# EAGLE design 25_Servo_Controller_v7.1 (EAGLE 5.00)
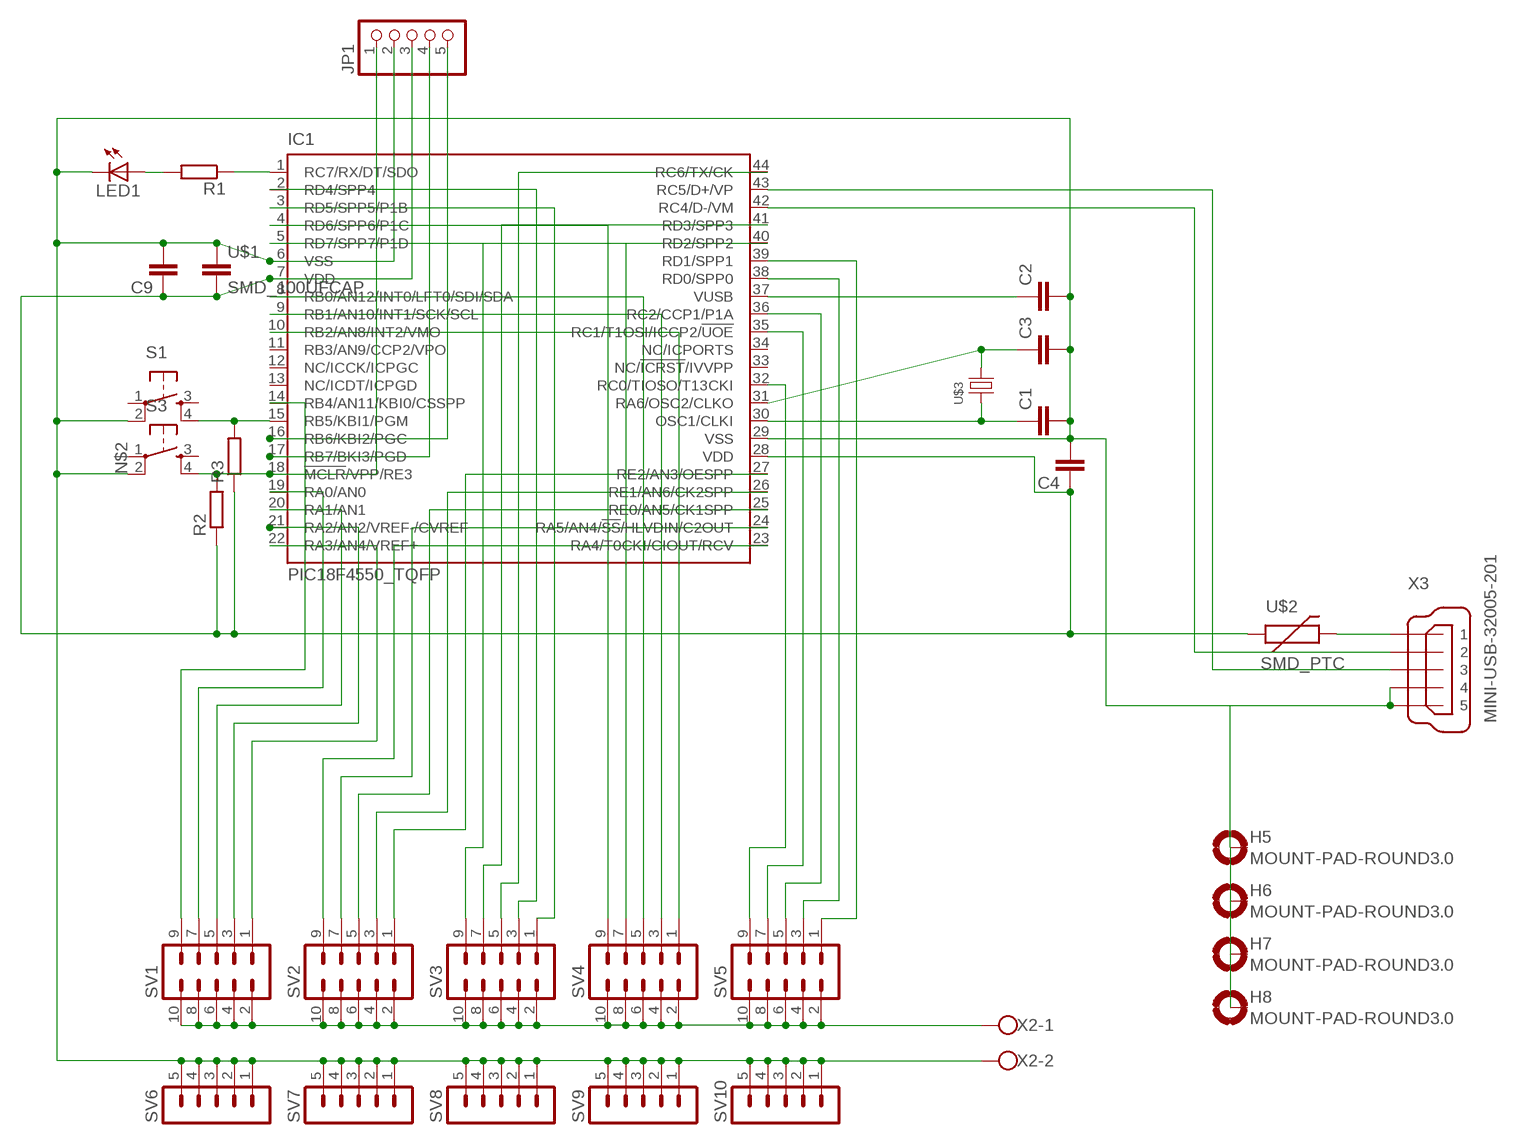
[diagram p0: schematic, sheet 1]

## Parts
C1  C-EUC0504  [C0504]
C2  C-EUC0504  [C0504]
C3  C-EUC0504  [C0504]
C4  C-EUC0504  [C0504]
C9  C-EUC0504  [C0504]
H5  MOUNT-PAD-ROUND3.0  [3,0-PAD]
H6  MOUNT-PAD-ROUND3.0  [3,0-PAD]
H7  MOUNT-PAD-ROUND3.0  [3,0-PAD]
H8  MOUNT-PAD-ROUND3.0  [3,0-PAD]
IC1  PIC18F4550_TQFP  [TQFP44]
JP1  PINHD-1X5  [1X05]
LED1  LED0603  [LED-0603]
R1  R-EU_R0402  [R0402]
R2  R-EU_R0402  [R0402]
R3  R-EU_R0402  [R0402]
S1  TAC_SWITCHSMD  [TACTILE_SWITCH_SMD]
S3  TAC_SWITCHSMD  [TACTILE_SWITCH_SMD]
SV1  MA05-2  [MA05-2]
SV2  MA05-2  [MA05-2]
SV3  MA05-2  [MA05-2]
SV4  MA05-2  [MA05-2]
SV5  MA05-2  [MA05-2]
SV6  MA05-1  [MA05-1]
SV7  MA05-1  [MA05-1]
SV8  MA05-1  [MA05-1]
SV9  MA05-1  [MA05-1]
SV10  MA05-1  [MA05-1]
U$1  SMD_100UFCAP  [SMD_100UFCAP]
U$2  SMD_PTC  [SMD_PTC]
U$3  SMD_CRYSTAL  [SMD_CRYSTAL]
X2  W237-102  [W237-102]
X3  MINI-USB-32005-201  [32005-201]

## Nets
GND: C1.2 C2.2 C3.2 C4.2 C9.2 H5.B3,0(MOUNT) H6.B3,0(MOUNT) H7.B3,0(MOUNT) H8.B3,0(MOUNT) IC1.6(VSS) IC1.29(VSS) JP1.2 LED1.C S1.2 S3.2 SV6.1 SV6.2 SV6.3 SV6.4 SV6.5 SV7.1 SV7.2 SV7.3 SV7.4 SV7.5 SV8.1 SV8.2 SV8.3 SV8.4 SV8.5 SV9.1 SV9.2 SV9.3 SV9.4 SV9.5 SV10.1 SV10.2 SV10.3 SV10.4 SV10.5 U$1.1 X2.2 X3.4 X3.5
N$1: U$2.2 X3.1
N$2: IC1.18(!MCLR!/VPP/RE3) JP1.1 R2.2 S3.4
N$3: IC1.1(RC7/RX/DT/SDO) R1.1
N$4: LED1.A R1.2
N$5: C2.1 IC1.37(VUSB)
N$6: C3.1 IC1.31(RA6/OSC2/CLKO) U$3.3
N$7: C4.1 C9.1 IC1.7(VDD) IC1.28(VDD) JP1.3 R2.1 R3.1 U$1.2 U$2.1
N$8: IC1.15(RB5/KBI1/PGM) R3.2 S1.4
N$9: SV1.2 SV1.4 SV1.6 SV1.8 SV1.10 SV2.2 SV2.4 SV2.6 SV2.8 SV2.10 SV3.2 SV3.4 SV3.6 SV3.8 SV3.10 SV4.2 SV4.4 SV4.6 SV4.8 SV4.10 SV5.2 SV5.4 SV5.6 SV5.8 SV5.10 X2.1
N$10: IC1.14(RB4/AN11/KBI0/CSSPP) SV1.9
N$11: IC1.19(RA0/AN0) SV1.7
N$13: IC1.43(RC5/D+/VP) X3.3
N$14: IC1.42(RC4/D-/VM) X3.2
N$15: IC1.20(RA1/AN1) SV1.5
N$16: IC1.23(RA4/T0CKI/CIOUT/RCV) SV2.9
N$17: IC1.24(RA5/AN4/!SS!/HLVDIN/C2OUT) SV2.7
N$18: IC1.22(RA3/AN4/VREF+) SV1.1
N$19: IC1.17(RB7/BKI3/PGD) JP1.4
N$20: IC1.16(RB6/KBI2/PGC) JP1.5
N$21: IC1.25(RE0/AN5/CK1SPP) SV2.5
N$22: IC1.21(RA2/AN2/VREF-/CVREF) SV1.3
N$23: IC1.26(RE1/AN6/CK2SPP) SV2.3
N$24: IC1.27(RE2/AN3/OESPP) SV2.1
N$25: IC1.32(RC0/TIOSO/T13CKI) SV5.9
N$26: IC1.35(RC1/T1OSI/ICCP2/!UOE) SV5.7
N$27: IC1.36(RC2/CCP1/P1A) SV5.5
N$28: IC1.38(RD0/SPP0) SV5.3
N$29: IC1.39(RD1/SPP1) SV5.1
N$30: IC1.40(RD2/SPP2) SV3.9
N$31: IC1.41(RD3/SPP3) SV3.7
N$32: IC1.44(RC6/TX/CK) SV3.5
N$33: IC1.2(RD4/SPP4) SV3.3
N$34: IC1.3(RD5/SPP5/P1B) SV3.1
N$35: IC1.4(RD6/SPP6/P1C) SV4.9
N$36: IC1.5(RD7/SPP7/P1D) SV4.7
N$37: IC1.8(RB0/AN12/INT0/LFT0/SDI/SDA) SV4.5
N$38: IC1.9(RB1/AN10/INT1/SCK/SCL) SV4.3
N$39: IC1.10(RB2/AN8/INT2/VMO) SV4.1
N$40: C1.1 IC1.30(OSC1/CLKI) U$3.2
Unconnected: IC1.11(RB3/AN9/CCP2/VPO) IC1.12(NC/ICCK/ICPGC) IC1.13(NC/ICDT/ICPGD) IC1.33(NC/!ICRST!/IVVPP) IC1.34(NC/ICPORTS) S1.1 S1.3 S3.1 S3.3

## Library data of the parts
C1-C4 C9 = resistor:C-EU: CAPACITOR, European symbol
H5-H8 = holes:MOUNT-PAD-ROUND: MOUNTING PAD, round
IC1 = microchip:PIC18F4*_TQFP: USB Microcontrollers with nanoWatt Technology High-Performance, Enhanced Flash, 28/40/44-Pin, Source: http://ww1.microchip.com/downloads/en/devicedoc/39632c.pdf
JP1 = pinhead:PINHD-1X5: PIN HEADER
LED1 = SparkFun:LED: LEDs Standard schematic elements and footprints for 5mm, 3mm, 1206, and 0603 sized LEDs. 5mm - Spark Fun Electronics SKU : COM-00529 (and others)
R1-R3 = rcl:R-EU_: RESISTOR, European symbol
S1 S3 = SparkFun:TAC_SWITCH: Momentary Switch Button commonly used for reset or general input. Spark Fun Electronics SKU : COM-00097
SV1-SV5 = con-lstb:MA05-2: PIN HEADER
SV6-SV10 = con-lstb:MA05-1: PIN HEADER
U$1 = endurance_rc:SMD_100UFCAP
U$2 = endurance_rc:SMD_PTC
U$3 = endurance_rc:SMD_CRYSTAL
X2 = con-wago-500:W237-102: WAGO SCREW CLAMP
X3 = con-cypressindustries:MINI-USB-: MINI USB-B Conector Source: www.cypressindustries.com

## Board
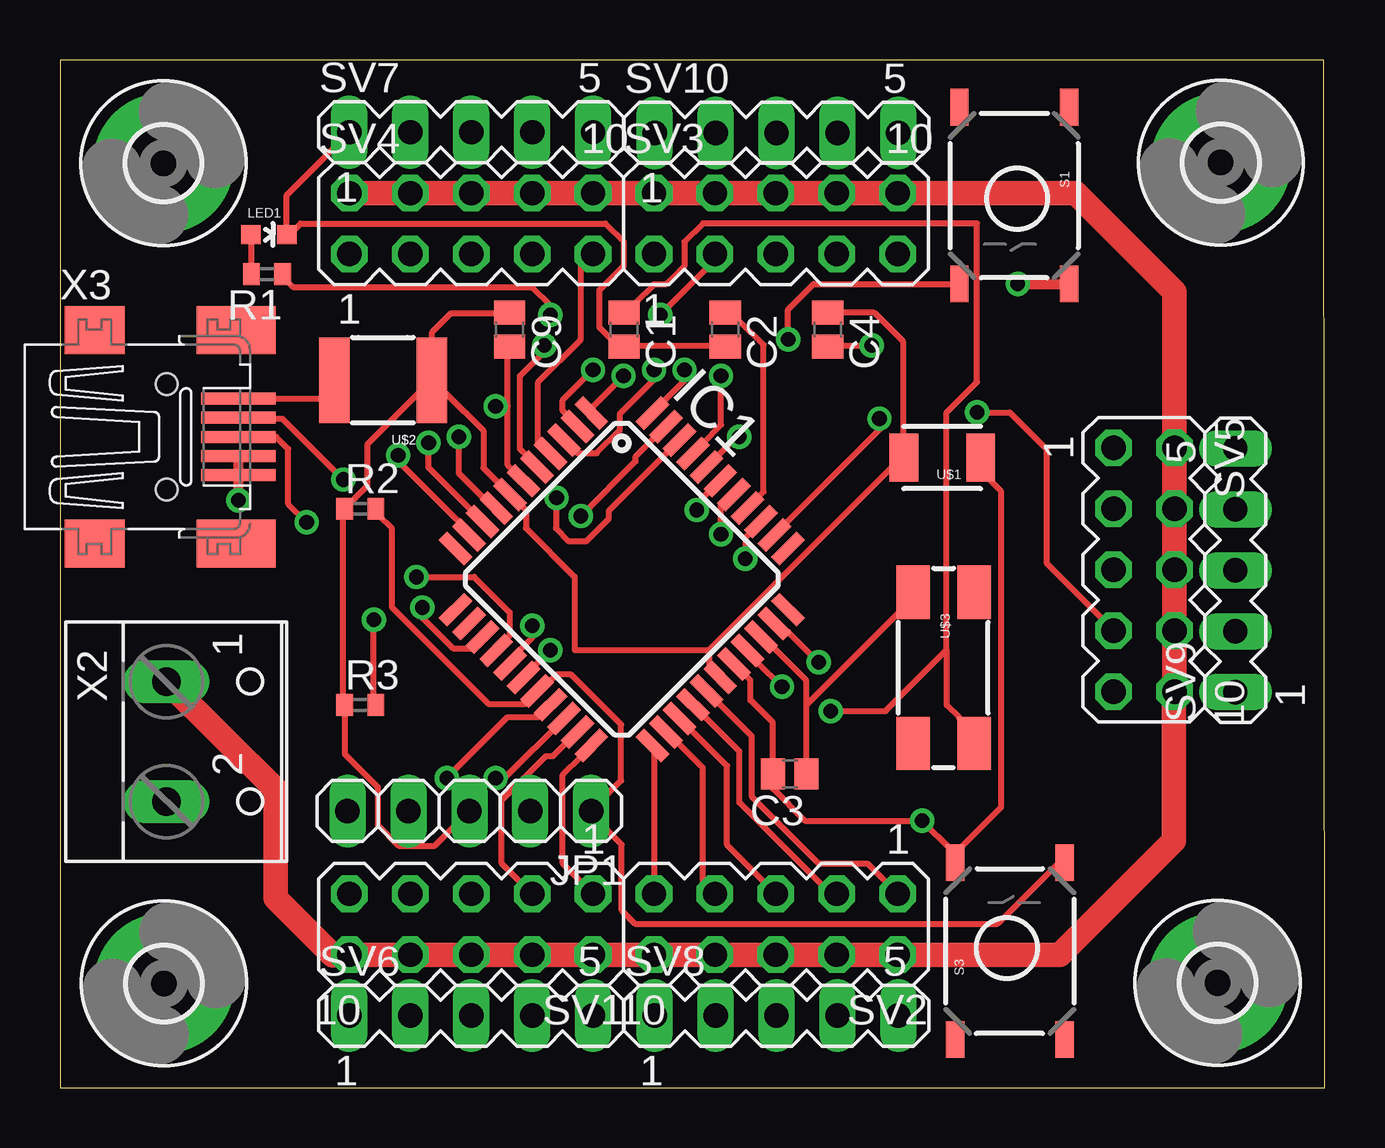
[diagram p1: board, top side]
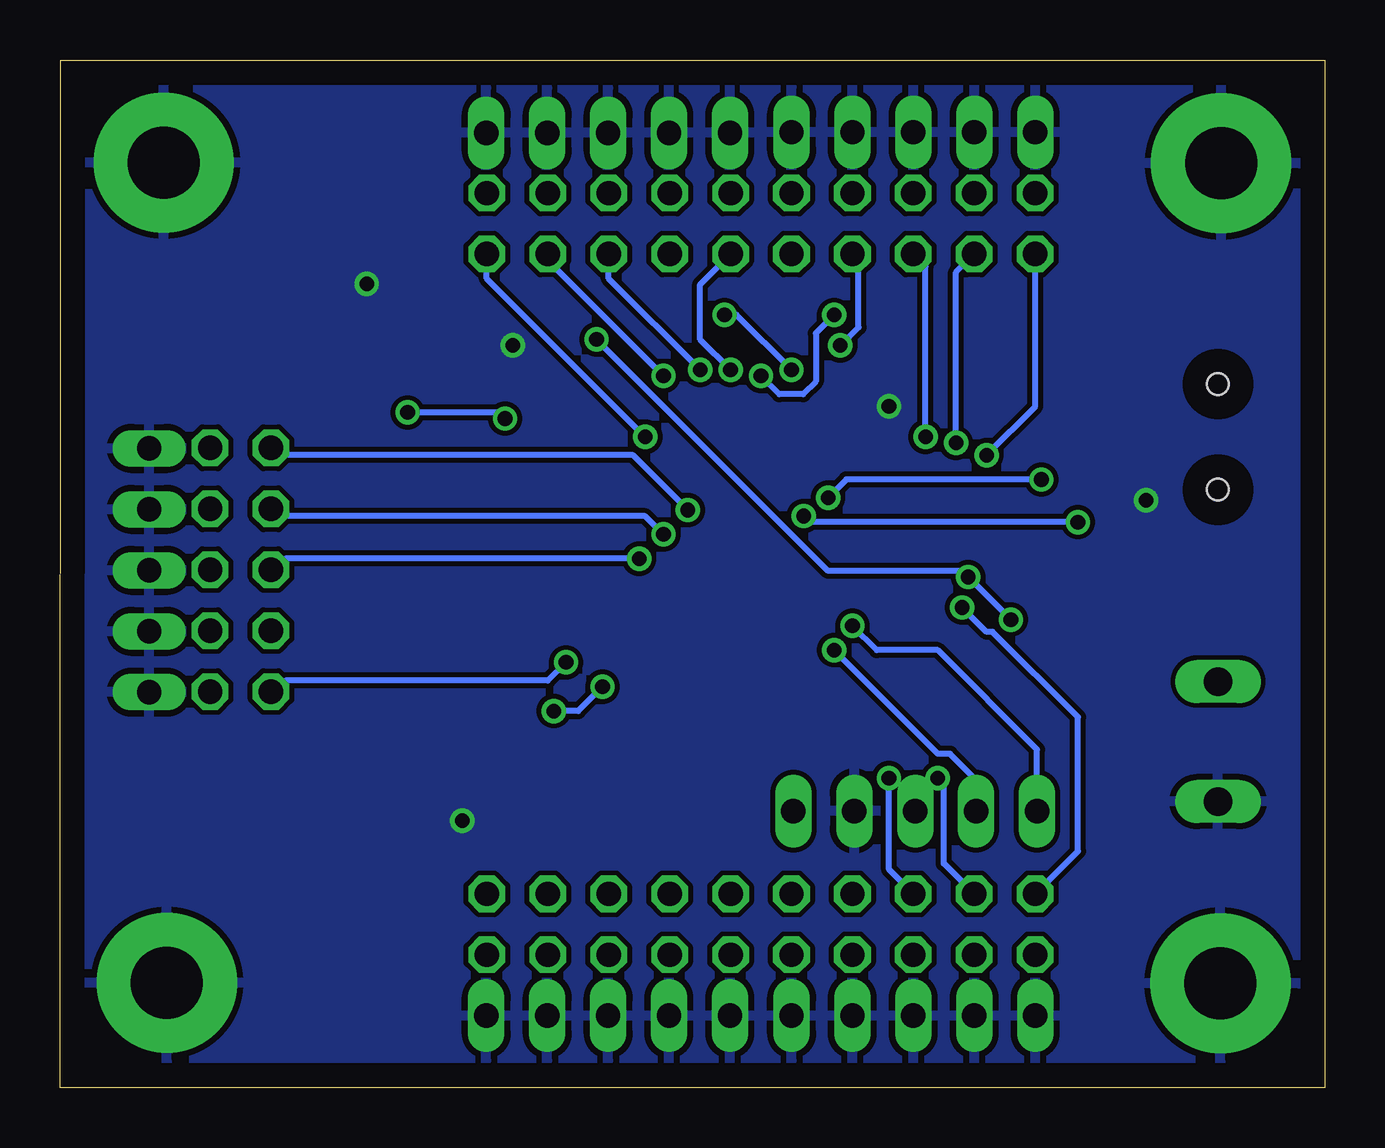
[diagram p2: board, bottom side, seen from below]

Size 52.71 x 42.85 mm. Coordinates in mm from the lower left corner, seen from the top.
Outline: 0,0 52.71,0 52.69,42.85 0,42.85 0,0
Copper layers (1*16): Top 0.035mm / dielectric 1.5mm / Bottom 0.035mm
Design rules "default *": minimum track width 10mil, minimum drill 24mil, track to track 8mil, track to pad 8mil, pad to pad 8mil, via to via 8mil, smd to smd 8mil, copper to edge 40mil, drill to drill 8mil, minimum pad ring 10mil, minimum via ring 8mil, stop-mask expansion 4mil, vias tented up to drill 0mil, thermal gap 10mil

### Footprints (pad centres in the part's own frame; a part is rotated, then mirrored left to right if it is on the bottom)
C0504 = smd 1 x 1.3: 1 -0.7,0; 2 0.7,0
3,0-PAD = drill 3 pad 5.842 round: B3,0 0,0
TQFP44 = smd 1.5 x 0.5: 1 -5.8,4; 2 -5.8,3.2; 3 -5.8,2.4; 4 -5.8,1.6; 5 -5.8,0.8; 6 -5.8,0; 7 -5.8,-0.8; 8 -5.8,-1.6; 9 -5.8,-2.4; 10 -5.8,-3.2; 11 -5.8,-4; 23 5.8,-4; 24 5.8,-3.2; 25 5.8,-2.4; 26 5.8,-1.6; 27 5.8,-0.8; 28 5.8,0; 29 5.8,0.8; 30 5.8,1.6; 31 5.8,2.4; 32 5.8,3.2; 33 5.8,4 | smd 0.5 x 1.5: 12 -4,-5.8; 13 -3.2,-5.8; 14 -2.4,-5.8; 15 -1.6,-5.8; 16 -0.8,-5.8; 17 0,-5.8; 18 0.8,-5.8; 19 1.6,-5.8; 20 2.4,-5.8; 21 3.2,-5.8; 22 4,-5.8; 34 4,5.8; 35 3.2,5.8; 36 2.4,5.8; 37 1.6,5.8; 38 0.8,5.8; 39 0,5.8; 40 -0.8,5.8; 41 -1.6,5.8; 42 -2.4,5.8; 43 -3.2,5.8; 44 -4,5.8
1X05 = drill 1.016 long: 1 -5.08,0; 2 -2.54,0; 3 0,0; 4 2.54,0; 5 5.08,0
LED-0603 = smd 0.8 x 0.8: A 0,-0.75; C 0,0.75
R0402 = smd 0.7 x 0.9: 1 -0.65,0; 2 0.65,0
TACTILE_SWITCH_SMD = smd 1.524 x 0.762: 1 -2.54,2.667; 2 4.826,2.667; 3 -2.54,-1.905; 4 4.826,-1.905
MA05-2 = drill 1.016 octagon: 1 -5.08,-1.27; 2 -5.08,1.27; 3 -2.54,-1.27; 4 -2.54,1.27; 5 0,-1.27; 6 0,1.27; 7 2.54,-1.27; 8 2.54,1.27; 9 5.08,-1.27; 10 5.08,1.27
MA05-1 = drill 1.016 long: 1 -5.08,0; 2 -2.54,0; 3 0,0; 4 2.54,0; 5 5.08,0
SMD_100UFCAP = smd 1.2 x 2: 1 -2.87,2.54; 2 0.33,2.54
SMD_PTC = smd 1.27 x 3.556: 1 -1.4,1.016; 2 2.664,1.016
SMD_CRYSTAL = smd 2.21 x 1.397: 1 -3.81,0.635; 2 2.489,0.635; 3 -3.81,-1.905; 4 2.489,-1.905
W237-102 = drill 1.194 long: 1 -2.5,-1.27; 2 2.5,-1.27
32005-201 = smd 3.1 x 0.5: 1 3,1.6; 2 3,0.8; 3 3,0; 4 3,-0.8; 5 3,-1.6 | smd 2.5 x 2: M1 -3,-4.45; M2 -3,4.45 | smd 3.3 x 2: M3 2.9,4.45; M4 2.9,-4.45 | hole 0.9: 0,2.2; 0,-2.2

### Placement (x,y rotation side)
C1  23.52,31.61 270 top
C2  27.73,31.61 270 top
C3  30.42,13.09 180 top
C4  32,31.61 270 top
C9  18.74,31.61 270 top
H5  4.34,4.36 0 top
H6  48.26,4.38 0 top
H7  48.38,38.57 0 top
H8  4.31,38.54 0 top
IC1  23.42,21.21 315 top
JP1  17.06,11.54 180 top
LED1  8.71,35.57 270 top
R1  8.63,33.92 180 top
R2  12.52,24.14 0 top
R3  12.52,15.96 0 top
S1  39.39,38.34 270 top
S3  39.97,4.56 90 top
SV1  17.14,6.82 180 top
SV2  29.84,6.82 180 top
SV3  29.84,36.03 0 top
SV4  17.14,36.03 0 top
SV5  45.18,21.6 270 top
SV6  17.14,3.01 0 top
SV7  17.14,39.84 0 top
SV8  29.87,3.01 0 top
SV9  48.99,21.58 90 top
SV10  29.87,39.81 0 top
U$1  35.5,28.82 180 top
U$2  14.09,30.52 180 top
U$3  37.46,16.85 270 top
X2  5.71,14.44 270 top
X3  4.44,27.14 0 top

### Tracks (layer width: path | path; a pad name or v marks a point on that pad's centre or on a via)
GND  (via drill 0.6, 0.61)
  Top 0.254: IC1.29 28.77,17 28.77,16.17 29.71,15.23 29.71,13.58 C3.2 29.71,12.48 31.06,11.14 v35.94,11.14 37.16,9.92 S3.2 37.46,9.94 39.24,11.72 39.24,24.85 38.73,25.36 U$1.1 | 18.66,28.41 18.66,25.97 18.92,25.72 IC1.6 | 18.66,28.41 18.66,30.44 C9.2 | X3.5 7.49,25.62 7.49,26.12 X3.4 | C2.2 27.3,30.95 24,30.95 C1.2 22.98,31.2 22.47,31.71 22.47,33.24 23.49,34.25 23.49,35.27 22.73,36.03 10.03,36.03 9.77,35.78 LED1.C 9.46,37.21 12.06,39.82 SV7.1 | v33.83,30.95 32.63,30.95 C4.2 | 18.66,28.41 v18.16,28.41
  Top 0.406: X3.4 7.44,24.6 v7.44,24.5 | v39.92,33.52 S1.2
  Bottom 0.406: v7.44,24.5 7.54,24.5
  pour Bottom: 0.33,42.63 52.45,42.58 52.37,0.22 0.25,0.27
N$1
  Top 0.254: X3.1 8.76,28.74 11.04,28.74 U$2.2
N$2
  Top 0.254: R2.2 13.33,23.84 13.84,23.33 13.84,20.03 17.88,15.99 19.4,15.99 IC1.18 20.44,16.98 20.7,17.23 21.31,17.23 23.39,15.15 23.39,12.81 22.14,11.57 JP1.1 22.14,11.42 23.41,10.15 23.41,7.4 23.97,6.85 39.09,6.85 41.63,9.38 S3.4
N$3  (via drill 0.61)
  Top 0.254: v23.49,29.68 22.22,28.41 IC1.1 | v20.44,32.22 20.44,32.6 19.65,33.39 9.72,33.39 9.24,33.87 R1.1
  Bottom 0.254: v20.44,32.22 21.2,31.46 21.2,29.45 21.74,28.92 22.73,28.92 v23.49,29.68
N$4
  Top 0.254: LED1.A 8,35.27 8,34.25 R1.2
N$5
  Top 0.254: C2.1 28.32,31.97 29.33,30.97 29.33,24.85 29.08,24.6 IC1.37
N$6
  Top 0.254: 31.11,15.96 31.11,16.98 29.59,18.5 IC1.31 | 31.11,15.96 31.11,13.68 C3.1 | 31.11,15.96 34.92,19.77 U$3.3
N$7
  Top 0.254: 27.05,18.25 27.05,17.49 IC1.28 | 27.05,18.25 34.67,25.87 U$1.2 | C9.1 18.26,32.3 16.3,32.3 15.51,31.51 U$2.1 | U$2.1 16.12,28.92 17.65,27.39 17.65,25.84 18.41,25.08 IC1.7 19.17,24.35 19.43,24.09 19.43,23.33 21.46,21.3 21.46,18.25 27.05,18.25 | JP1.3 15.62,10.1 14.12,10.1 13.25,10.96 13.25,12.54 11.88,13.91 11.88,15.84 R3.1 11.81,16.22 11.81,23.84 R2.1 12.06,24.35 12.82,25.11 12.82,26.83 U$2.1 | C4.1 33.94,32.31 35.15,31.1 35.15,26.25 U$1.2 | U$1.2
N$8  (via drill 0.61)
  Top 0.254: v13.08,19.52 13.08,16.22 R3.2 | v30.35,31.2 30.35,32.45 31.41,33.52 S1.4 37.51,33.52 | v14.85,21.3 17.27,21.3 18.74,19.82 18.74,18.86 18.13,18.25 18.14,18.24 IC1.15
  Bottom 0.254: v13.08,19.52 v14.85,21.3 15.11,21.55 20.7,21.55 v30.35,31.2
N$9
  Top 1.016: X2.1 8.99,12.43 8.99,7.91 11.37,5.53 11.88,5.53 11.93,5.58 11.96,5.55 SV1.10 14.47,5.55 14.5,5.53 14.52,5.55 SV1.8 16.96,5.55 16.99,5.53 17.01,5.55 SV1.6 SV1.4 | SV1.4 19.7,5.53 | 22.22,5.58 22.24,5.6 | 22.22,5.58 SV1.2 24.73,5.55 24.76,5.53 SV2.10 SV2.8 | SV1.4 22.2,5.55 22.22,5.58 | SV2.8 27.32,5.55 27.35,5.58 | SV2.8 29.71,5.55 29.74,5.58 29.76,5.55 SV2.6 SV2.4 34.87,5.55 34.9,5.58 SV2.2 41.68,5.55 46.43,10.3 46.43,16.52 SV5.10 46.45,18.91 46.38,18.99 SV5.8 SV5.6 | SV5.6 46.48,21.63 | SV5.6 46.45,23.99 46.33,24.12 46.35,24.14 SV5.4 46.45,26.66 46.48,26.68 SV5.2 46.45,26.63 | SV4.4 14.65,37.3 | SV4.4 SV4.2 | SV4.6 17.16,37.3 | SV4.6 SV4.4 | SV4.8 19.83,37.3 | SV4.8 SV4.6 | SV4.10 SV4.8 | SV4.10 22.32,37.2 | 24.76,37.33 24.81,37.38 | 24.76,37.33 SV3.2 SV3.4 29.71,37.3 29.74,37.27 29.76,37.3 SV3.6 SV3.8 34.77,37.3 34.79,37.27 34.82,37.3 SV3.10 42.34,37.3 46.45,33.19 46.45,26.63 | SV4.10 24.73,37.3 24.76,37.33 | 46.45,26.63 46.48,26.61
N$10  (via drill 0.61)
  Top 0.254: v15.11,20.03 15.11,19.77 15.08,19.62 16.38,18.33 17.16,18.33 IC1.14
  Bottom 0.254: v15.11,20.03 14.09,19.01 13.84,19.01 10.28,15.46 10.28,9.87 SV1.9
N$11  (via drill 0.61)
  Top 0.254: IC1.19 19.93,15.46 18.66,15.46 v16.12,12.92
  Bottom 0.254: v16.12,12.92 15.87,12.64 15.87,9.36 SV1.7
N$13  (via drill 0.61)
  Top 0.254: v21.71,23.84 24,26.12 24,26.33 24.76,27.09 IC1.43 | v10.28,23.58 9.52,24.35 9.52,26.63 9.01,27.14 X3.3
  Bottom 0.254: v21.71,23.84 21.46,23.58 v10.28,23.58
N$14  (via drill 0.61)
  Top 0.254: v11.81,25.36 9.27,27.9 8.76,27.9 X3.2 | IC1.42 25.42,26.61 22.88,24.07 22.88,23.74 21.94,22.8 21.2,22.8 20.67,23.33 20.67,24.57 v20.7,24.6
  Bottom 0.254: v20.7,24.6 19.93,25.36 v11.81,25.36
N$15  (via drill 0.61)
  Top 0.254: IC1.20 21.02,15.41 21.03,15.4 18.54,12.92 v18.16,12.92
  Bottom 0.254: v18.16,12.92 18.16,9.11 SV1.5
N$16
  Top 0.254: IC1.23 24.79,14.01 24.79,8.6 SV2.9
N$17
  Top 0.254: IC1.24 25.78,14.36 26.79,13.35 26.79,8.6 SV2.7
N$18
  Top 0.254: IC1.22 21.71,13.8 20.95,13.04 20.95,9.36 SV1.1
N$19  (via drill 0.61)
  Top 0.254: v20.44,18.25 19.78,17.59 IC1.17
  Bottom 0.254: v20.44,18.25 16.12,13.93 15.62,13.93 14.52,12.84 JP1.4
N$20  (via drill 0.61)
  Top 0.254: v19.68,19.27 19.68,18.76 19.17,18.25 IC1.16
  Bottom 0.254: v19.68,19.27 18.66,18.25 16.12,18.25 11.98,14.11 JP1.5
N$21
  Top 0.254: IC1.25 27.81,13.42 27.81,10.12 SV2.5
N$22
  Top 0.254: SV1.3 18.41,9.36 18.41,11.98 20.26,13.83 20.54,13.83 21.56,14.85 21.56,14.84 IC1.21
N$23
  Top 0.254: IC1.26 26.79,15.56 28.32,14.03 28.32,11.9 32.13,8.09 SV2.3
N$24
  Top 0.254: IC1.27 27.3,16.19 28.82,14.67 28.82,12.15 31.62,9.36 33.65,9.36 SV2.1
N$25  (via drill 0.61)
  Top 0.254: v31.62,17.74 30.35,19.01 IC1.32
  Bottom 0.254: v31.62,17.74 32.38,16.98 43.3,16.98 SV5.9
N$26  (via drill 0.61)
  Top 0.254: IC1.35 30.17,23.43 30.17,23.46 34.16,27.44 v34.16,27.9 | v38.22,28.16 39.59,28.16 41.12,26.63 41.12,21.88 43.94,19.06 | 43.94,19.06 43.96,19.04 | 43.94,19.06 SV5.7
  Bottom 0.254: v34.16,27.9 34.41,28.16 v38.22,28.16
N$27  (via drill 0.61)
  Top 0.254: v28.57,22.06 28.57,22.95 28.82,23.2 IC1.36
  Bottom 0.254: v28.57,22.06 43.3,22.06 SV5.5
N$28  (via drill 0.61)
  Top 0.254: v27.55,23.08 27.55,24.35 IC1.38
  Bottom 0.254: v27.55,23.08 28.32,23.84 43.3,23.84 SV5.3
N$29  (via drill 0.61)
  Top 0.254: v26.54,24.09 26.54,24.35 27.05,24.85 IC1.39
  Bottom 0.254: v26.54,24.09 28.82,26.38 43.3,26.38 SV5.1
N$30  (via drill 0.61)
  Top 0.254: v28.32,27.14 28.29,27.22 27.32,26.25 IC1.40
  Bottom 0.254: v28.32,27.14 34.92,33.74 SV3.9
N$31  (via drill 0.61)
  Top 0.254: v27.55,29.68 27.55,27.65 26.79,26.89 IC1.41
  Bottom 0.254: v27.55,29.68 32.2,34.33 32.38,34.53 SV3.7
N$32  (via drill 0.61)
  Top 0.254: v26.03,29.93 26.03,29.48 25.14,28.59 IC1.44
  Bottom 0.254: v26.03,29.93 29.84,33.74 SV3.5
N$33  (via drill 0.61)
  Top 0.254: v22.22,29.93 20.95,28.66 20.95,28.23 21.2,27.98 IC1.2 | v25.01,32.22 27.22,34.43 27.27,34.58 SV3.3
  Bottom 0.254: v22.22,29.93 24.51,32.22 v25.01,32.22
N$34  (via drill 0.61)
  Top 0.254: IC1.3 21.46,26.63 21.46,26.58 21.58,26.45 22.37,26.45 23.34,27.42 23.34,28.1 24.76,29.53 v24.76,29.93
  Bottom 0.254: v24.76,29.93 26.03,31.2 26.03,33.49 SV3.1
N$35
  Top 0.254: IC1.4 19.93,26.89 19.93,29.43 21.71,31.2 21.71,34.25 SV4.9
N$36  (via drill 0.61)
  Top 0.254: v20.19,30.95 20.19,30.7 19.17,29.68 19.17,26.63 19.43,26.38 IC1.5
  Bottom 0.254: v20.19,30.95 19.43,31.71 19.43,34.25 SV4.7
N$37  (via drill 0.61)
  Top 0.254: v16.63,27.14 16.63,25.62 17.65,24.6 IC1.8
  Bottom 0.254: v16.63,27.14 16.63,34.25 SV4.5
N$38  (via drill 0.61)
  Top 0.254: v15.36,26.89 15.36,25.87 IC1.9
  Bottom 0.254: v15.36,26.89 15.36,34 SV4.3
N$39  (via drill 0.61)
  Top 0.254: v14.09,26.38 14.09,26.12 16.63,23.58 IC1.10
  Bottom 0.254: v14.09,26.38 12.06,28.41 SV4.1
N$40  (via drill 0.61)
  Top 0.254: 36.95,18.25 36.95,15.96 37.46,15.46 U$3.2 | 36.95,18.25 36.95,28.16 38.22,29.43 38.22,36.03 26.79,36.03 26.03,35.27 26.03,34.25 25.52,33.74 25.24,33.49 24.76,33.49 24,32.73 C1.1 | v30.09,16.73 29.08,17.74 IC1.30 | v32.13,15.71 34.41,15.71 36.95,18.25
  Bottom 0.254: v30.09,16.73 31.11,15.71 v32.13,15.71

### Text on the board
text: 25 | 24 | 23 | 22 | 21 | 20 | 19 | 18 | 17 | 16 | PROGRAM | USB | 15 | 14 | 13 | +V | 12 | 11 | 25 Servo Controller v1.3 | (c) Endurance R/C | www.endurance-rc.com | GND | RESET | 1 | 2 | 3 | 4 | 5 | 6 | 7 | 8 | 9 | 10